# Altium schematic sheet usb.SchDoc
size A3
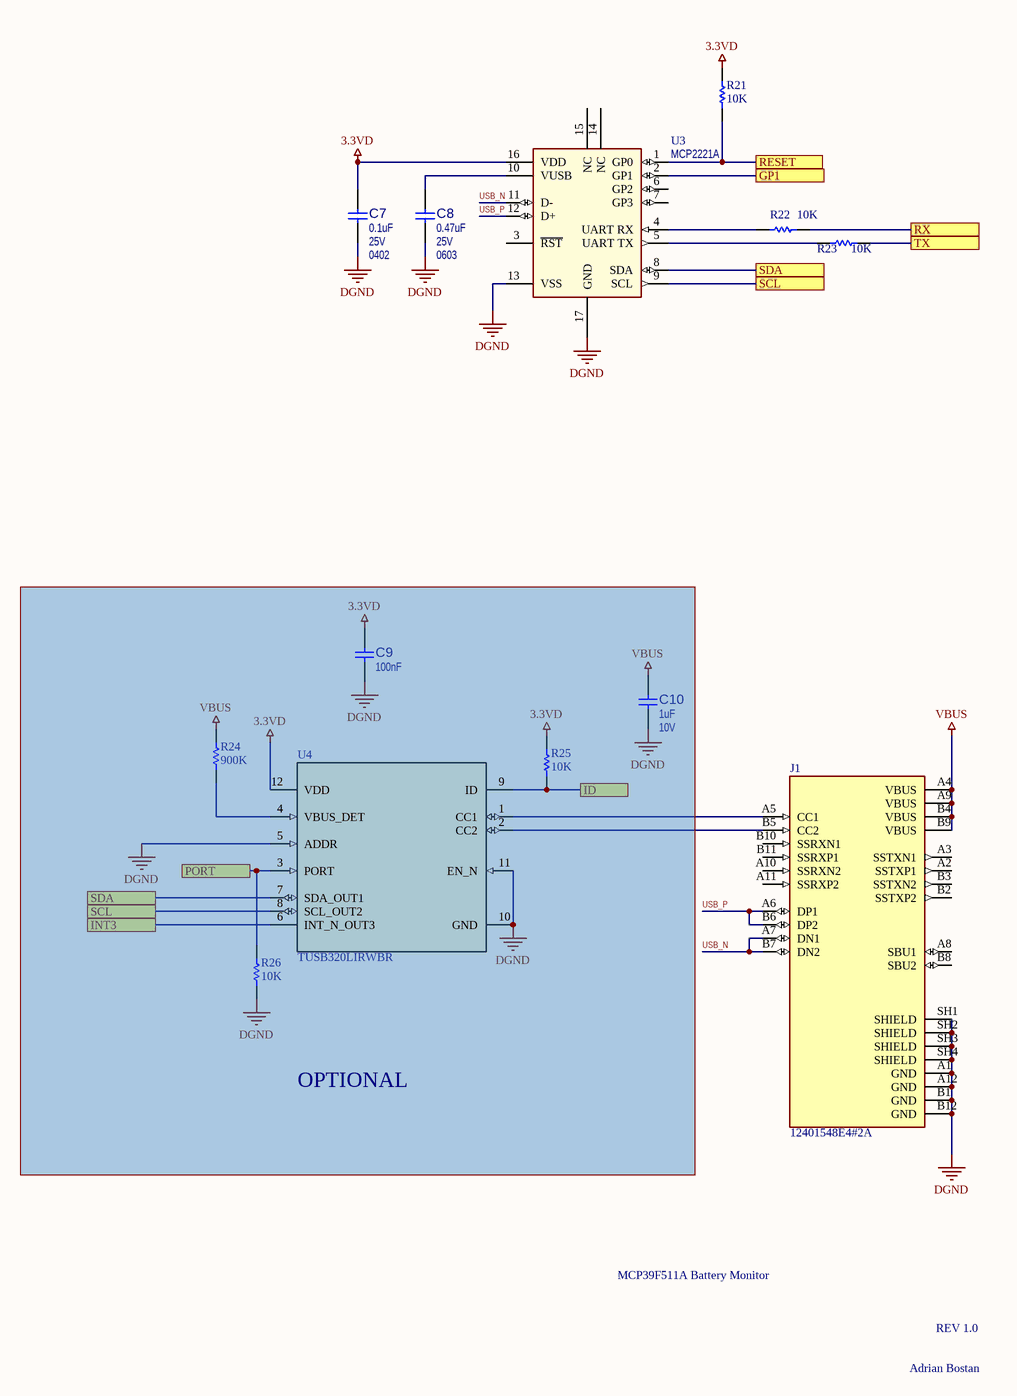
[diagram p0: usb.SchDoc]

## Parts
C7  value 0.1uF  Voltage: 25V  Package: 0402  [CAP0603M]
C8  value 0.47uF  Voltage: 25V  Package: 0603  [CAP0603M]
C9  value 100nF  [CAP0603M]
C10  value 1uF  Voltage: 10V  [CAP0603M]
J1  12401548E4#2A  [12401548E4#2A]
R21  value 10K  [RES0603M]  (hidden comment: Res1)
R22  value 10K  [RES0603M]  (hidden comment: Res1)
R23  value 10K  [RES0603M]  (hidden comment: Res1)
R24  value 900K  [RES0603M]  (hidden comment: Res1)
R25  value 10K  [RES0603M]  (hidden comment: Res1)
R26  value 10K  [RES0603M]  (hidden comment: Res1)
U3  value MCP2221A  [QFN65P400X400X95-17N]  (hidden comment: MCP2221)
U4  TUSB320LIRWBR  [12-x2qfn]

## Blocks framed on the sheet
OPTIONAL: C9 C10 R24-R26 U4

## Ports
GP1, ID, INT3, PORT, RESET, RX, SCL, SDA, TX

## Nets
3.3VD: C7.2 C9.1 R21.2 R25.2 U3.16(VDD) U4.12(VDD)
DGND: C7.1 C8.1 C9.2 C10.1 J1.A1(GND) J1.A12(GND) J1.B1(GND) J1.B12(GND) J1.SH1(SHIELD) J1.SH2(SHIELD) J1.SH3(SHIELD) J1.SH4(SHIELD) R26.1 U3.13(VSS) U3.17(GND) U4.5(ADDR) U4.10(GND) U4.11(EN_N)
VBUS: C10.2 J1.A4(VBUS) J1.A9(VBUS) J1.B4(VBUS) J1.B9(VBUS) R24.2
GP1: U3.2(GP1) ; port GP1
ID: R25.1 U4.9(ID) ; port ID
INT3: U4.6(INT_N_OUT3) ; port INT3
PORT: R26.2 U4.3(PORT) ; port PORT
RESET: R21.1 U3.1(GP0) ; port RESET
RX: R22.1 ; port RX
SCL: U3.9(SCL) U4.8(SCL_OUT2) ; port SCL
SDA: U3.8(SDA) U4.7(SDA_OUT1) ; port SDA
TX: R23.1 ; port TX
USB_N: J1.A7(DN1) J1.B7(DN2) U3.11(D-)
USB_P: J1.A6(DP1) J1.B6(DP2) U3.12(D+)
NetC8_2: C8.2 U3.10(VUSB)
NetJ1_A5: J1.A5(CC1) U4.1(CC1)
NetJ1_B5: J1.B5(CC2) U4.2(CC2)
NetR22_2: R22.2 U3.4(UART_RX)
NetR23_2: R23.2 U3.5(UART_TX)
NetR24_1: R24.1 U4.4(VBUS_DET)

Not connected (* = marked no-connect by the designer): J1 A2(SSTXP1) A3(SSTXN1) A8(SBU1) A10(SSRXN2) A11(SSRXP2) B2(SSTXP2) B3(SSTXN2) B8(SBU2) B10(SSRXN1) B11(SSRXP1); U3 3(~{RST}) 6(GP2) 7(GP3) 14(NC) 15(NC)

## Notes on the sheet
- MCP39F511A Battery Monitor
- REV 1.0
- Adrian Bostan

## Library data of the parts
C7 = CAP1345: Capacitor; Manufacturer 1: TDK Corporation; Manufacturer Part Number 1: C1005X7R1E104K050BB; Description_: CAP CER 0.1uF 25V 10% X7R SMD 0402; Dev Tools Status: Production; Tolerance: 10%; Temperature Coeffcient: X7R; Type: Ceramic; Owner: Randolph Sobrepena; Populated: YES; MCHP-ID: CAP1345; Revision: 1; Symbol: Capacitor NP; Status: MCL Design; ComponentLink1URL: https://chn-vm-apps.microchip.com/mchprepo/parts/Datasheets/mlcc_commercial_general_en; ComponentLink1Description: SVN Datasheet; ComponentLink2URL: C:\ALTIUM_WORK\00001_MCHP-CDB\Datasheets\mlcc_commercial_general_en; ComponentLink2Description: Local Datasheet; ComponentLink3URL: C:\ALTIUM_WORK\00001_MCHP-CDB\Library\LibraryRefs\Capacitor NP.SchLib; ComponentLink3Description: Open Symbol; ComponentLink4URL: C:\ALTIUM_WORK\00001_MCHP-CDB\Library\Footprints\CAP_C_0402.PcbLib; ComponentLink4Description: Open Footprint; ComponentLink5Description: Open Footprint 2; ComponentLink6Description: Open Footprint 3; ComponentLink7Description: Open Footprint 4; Operating Temperature: -55°C to 125°C; Category: Capacitor; Supplier 1: Digi-Key; Supplier Part Number 1: 445-7348-1-ND; Quantity Override: 1
C8 = CAP1224: Capacitor; Manufacturer 1: Murata; Manufacturer Part Number 1: GRM188R71E474KA12D; Description_: CAP CER 0.47uF 25V 10% X7R SMD 0603; Dev Tools Status: Production; Tolerance: 10%; Temperature Coeffcient: X7R; Type: Ceramic; Owner: Tad Ahlvers; Populated: YES; MCHP-ID: CAP1224; Revision: 0; Symbol: Capacitor NP; Status: MCL Design; ComponentLink1URL: https://chn-vm-apps.microchip.com/mchprepo/parts/Datasheets/L0005E.pdf; ComponentLink1Description: SVN Datasheet; ComponentLink2URL: C:\ALTIUM_WORK\00001_MCHP-CDB\Datasheets\L0005E.pdf; ComponentLink2Description: Local Datasheet; ComponentLink3URL: C:\ALTIUM_WORK\00001_MCHP-CDB\Library\LibraryRefs\Capacitor NP.SchLib; ComponentLink3Description: Open Symbol; ComponentLink4URL: C:\ALTIUM_WORK\00001_MCHP-CDB\Library\Footprints\CAP_C_0603.PcbLib; ComponentLink4Description: Open Footprint; ComponentLink5Description: Open Footprint 2; ComponentLink6Description: Open Footprint 3; ComponentLink7Description: Open Footprint 4; Operating Temperature: -55C to +125C; Category: Capacitor; Supplier 1: Digi-Key; Supplier Part Number 1: 490-3291-1-ND; Quantity Override: 1
C9 C10 = CAP1183: Capacitor; Manufacturer 1: Murata Electronics North America; Manufacturer Part Number 1: GRM155R61A105KE15D; Description_: CAP CER 1uF 10V 10% X5R SMD 0402; Dev Tools Status: Production; Tolerance: 10%; Temperature Coeffcient: X5R; Type: Ceramic; Owner: Aaron VanDuerm; Populated: YES; MCHP-ID: CAP1183; Revision: 0; Symbol: Capacitor NP; Status: MCL Design; ComponentLink1URL: https://chn-vm-apps.microchip.com/mchprepo/parts/Datasheets/CL05A105KP5NNNC1.pdf; ComponentLink1Description: SVN Datasheet; ComponentLink2URL: C:\ALTIUM_WORK\00001_MCHP-CDB\Datasheets\CL05A105KP5NNNC1.pdf; ComponentLink2Description: Local Datasheet; ComponentLink3URL: C:\ALTIUM_WORK\00001_MCHP-CDB\Library\LibraryRefs\Capacitor NP.SchLib; ComponentLink3Description: Open Symbol; ComponentLink4URL: C:\ALTIUM_WORK\00001_MCHP-CDB\Library\Footprints\CAP_C_0402.PcbLib; ComponentLink4Description: Open Footprint; ComponentLink5Description: Open Footprint 2; ComponentLink6Description: Open Footprint 3; ComponentLink7Description: Open Footprint 4; Operating Temperature: -55C to +85C; Category: Capacitor; Supplier 1: Digi-Key; Supplier Part Number 1: 490-3890-1-ND; Quantity Override: 1; Manufacturer 2: Samsung; Manufacturer Part Number 2: CL05A105KP5NNNC; Supplier 2: Digi-Key; Supplier Part Number 2: 1276-1076-2-ND
J1 = 12401548E4#2A: USB-C _USB TYPE-C_ USB 3.1 _USB 3.1 Gen 2, Superspeed+_ Receptacle Connector 24 Position Surface Mount, Right Angle; Through Hole; MF: Amphenol ICC; SnapEDA_Link: https://www.snapeda.com/parts/12401548E4%232A/Amphenol%20FCI/view-part/2874173/?ref=snap; Price: None; Availability: Unavailable; Value: *; MP: 12401548E4#2A; Package: None
R21-R26 = Res1: Resistor; Published: 8-Jun-2000; LatestRevisionDate: 17-Jul-2002; LatestRevisionNote: Re-released for DXP Platform.; PackageReference: AXIAL-0.3; Publisher: Altium Limited; PackageDescription: Axial Device, Thru-Hole; 2 Leads; 0.3 in Pin Spacing
U3 = MCP2221: Manufacturer 1: Microchip Technology; Manufacturer Part Number 1: MCP2221A-I/ST; MCHP-ID: MIC6555; Description_: MCHP INTERFACE USB I2C UART MCP2221A-I/ST TSSOP-14; Symbol: MCP2221 SOIC-14_TSSOP-14_PDIP-14; Dev Tools Status: Production; Owner: Tim Moffat; Populated: YES; Type: USB; Status: MCL Design; Revision: 1; Category: MCHP-Interface; ComponentLink1Description: SVN Datasheet; ComponentLink2URL: C:\ALTIUM_WORK\00001_MCHP-CDB\Datasheets\20005292B.pdf; ComponentLink2Description: Local Datasheet; ComponentLink3URL: C:\ALTIUM_WORK\00001_MCHP-CDB\Library\LibraryRefs\MCP2221 SOIC-14_TSSOP-14_PDIP-14.SchLib; ComponentLink3Description: Open Symbol; ComponentLink4URL: C:\ALTIUM_WORK\00001_MCHP-CDB\Library\Footprints\TSSOP-14.PcbLib; ComponentLink4Description: Open Footprint; ComponentLink5Description: Open Footprint 2; ComponentLink6Description: Open Footprint 3; ComponentLink7Description: Open Footprint 4; Supplier 1: Microchip Technology; Supplier Part Number 1: MCP2221A-I/ST; Quantity Override: 1
U4 = TUSB320LIRWBR: Imported; Manufacturer: Texas Instruments; CompType: IC; PIN_COUNT: 12; Application_BuildNumber: *; PartNumber: TUSB320LIRWBR; PackageReference: RWB0012A; MountType: SMT; RoHS: Y; RefDes: RefDes; TYPE: TYPE; Value: Value